# Altium schematic sheet TelecarMasterDriver.SchDoc
size 190 x 120 mm; PageSetup: Record=PageOptions?CenterHorizontal=True?CenterVertical=True?PrintScale=0.67?XCorrection=1.00?YCorrection=1.00?PrintKind=1?BorderSize=5000000?LeftOffset=0?BottomOffset=0?Orientation=2?PaperLength=1000?PaperWidth=1000?Scale=100?PaperSource=7?PrintQuality=-4?MediaType=1?DitherType=10?PaperKind=A5?PrintScaleMode=1
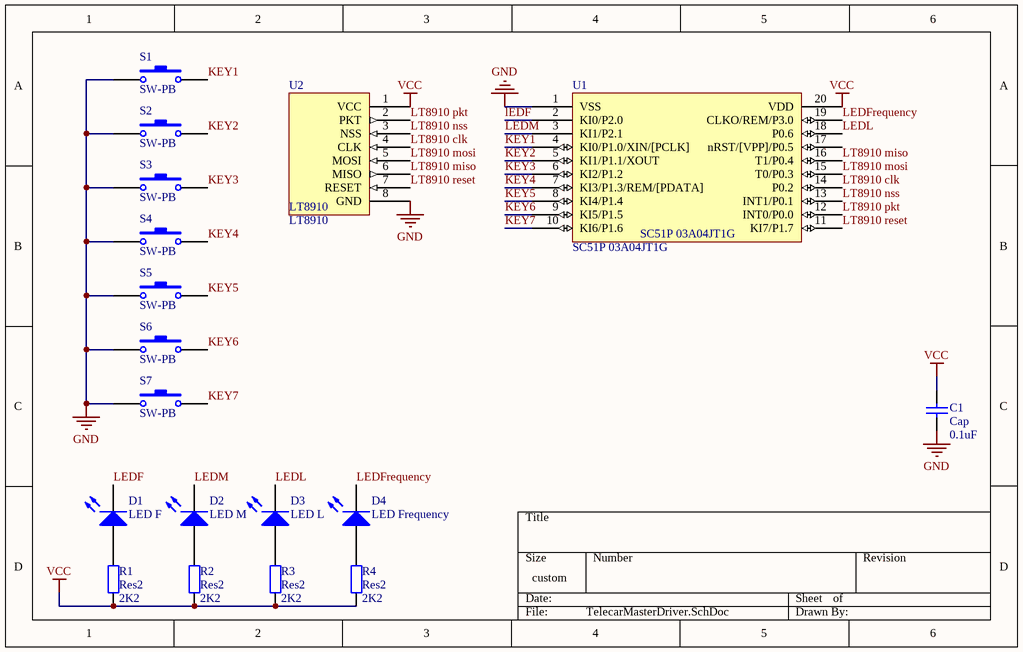
[diagram p0: TelecarMasterDriver.SchDoc]

## Parts
C1  Cap  value 0.1uF  [RAD-0.3]
D1  LED F  [LED-1]
D2  LED M  [LED-1]
D3  LED L  [LED-1]
D4  LED Frequency  [LED-1]
R1  Res2  value 2K2  [AXIAL-0.4]
R2  Res2  value 2K2  [AXIAL-0.4]
R3  Res2  value 2K2  [AXIAL-0.4]
R4  Res2  value 2K2  [AXIAL-0.4]
S1  SW-PB  [SPST-2]
S2  SW-PB  [SPST-2]
S3  SW-PB  [SPST-2]
S4  SW-PB  [SPST-2]
S5  SW-PB  [SPST-2]
S6  SW-PB  [SPST-2]
S7  SW-PB  [SPST-2]
U1  SC51P 03A04JT1G
U2  LT8910

## Nets
GND: C1.1 S1.1 S2.1 S3.1 S4.1 S5.1 S6.1 S7.1 U1.1(VSS) U2.8(GND)
VCC: C1.2 R1.1 R2.1 R3.1 R4.1 U1.20(VDD) U2.1(VCC)
KEY1: S1.2 U1.4(KI0/P1.0/XIN/[PCLK])
KEY2: S2.2 U1.5(KI1/P1.1/XOUT)
KEY3: S3.2 U1.6(KI2/P1.2)
KEY4: S4.2 U1.7(KI3/P1.3/REM/[PDATA])
KEY5: S5.2 U1.8(KI4/P1.4)
KEY6: S6.2 U1.9(KI5/P1.5)
KEY7: S7.2 U1.10(KI6/P1.6)
LEDF: D1.2(K) U1.2(KI0/P2.0)
LEDFrequency: D4.2(K) U1.19(CLKO/REM/P3.0)
LEDL: D3.2(K) U1.18(P0.6)
LEDM: D2.2(K) U1.3(KI1/P2.1)
LT8910 clk: U1.14(P0.2) U2.4(CLK)
LT8910 miso: U1.16(T1/P0.4) U2.6(MISO)
LT8910 mosi: U1.15(T0/P0.3) U2.5(MOSI)
LT8910 nss: U1.13(INT1/P0.1) U2.3(NSS)
LT8910 pkt: U1.12(INT0/P0.0) U2.2(PKT)
LT8910 reset: U1.11(KI7/P1.7) U2.7(RESET)
NetD1_1: D1.1(A) R1.2
NetD2_1: D2.1(A) R2.2
NetD3_1: D3.1(A) R3.2
NetD4_1: D4.1(A) R4.2

Not connected (* = marked no-connect by the designer): U1 17(nRST/[VPP]/P0.5)

## Library data of the parts
C1 = Cap: Capacitor; Published: 8-Jun-2000; LatestRevisionDate: 17-Jul-2002; LatestRevisionNote: Re-released for DXP Platform.; PackageReference: RAD-0.3; Publisher: Altium Limited
D1-D4 = LED1: Typical RED GaAs LED; Published: 8-Jun-2000; LatestRevisionDate: 08-Jul-2005; LatestRevisionNote: Mech Layer 1 removed.; PackageReference: LED-1; Publisher: Altium Limited
R1-R4 = Res2: Resistor; Published: 8-Jun-2000; LatestRevisionDate: 17-Jul-2002; LatestRevisionNote: Re-released for DXP Platform.; PackageReference: AXIAL-0.4; Publisher: Altium Limited
S1-S7 = SW-PB: Switch; Published: 24-Mar-1999; LatestRevisionDate: 17-Jul-2002; LatestRevisionNote: Re-released for DXP Platform.; PackageReference: SPST-2; Publisher: Altium Limited